# Altium schematic sheet mainSchematic.SchDoc
size 431 x 381 mm
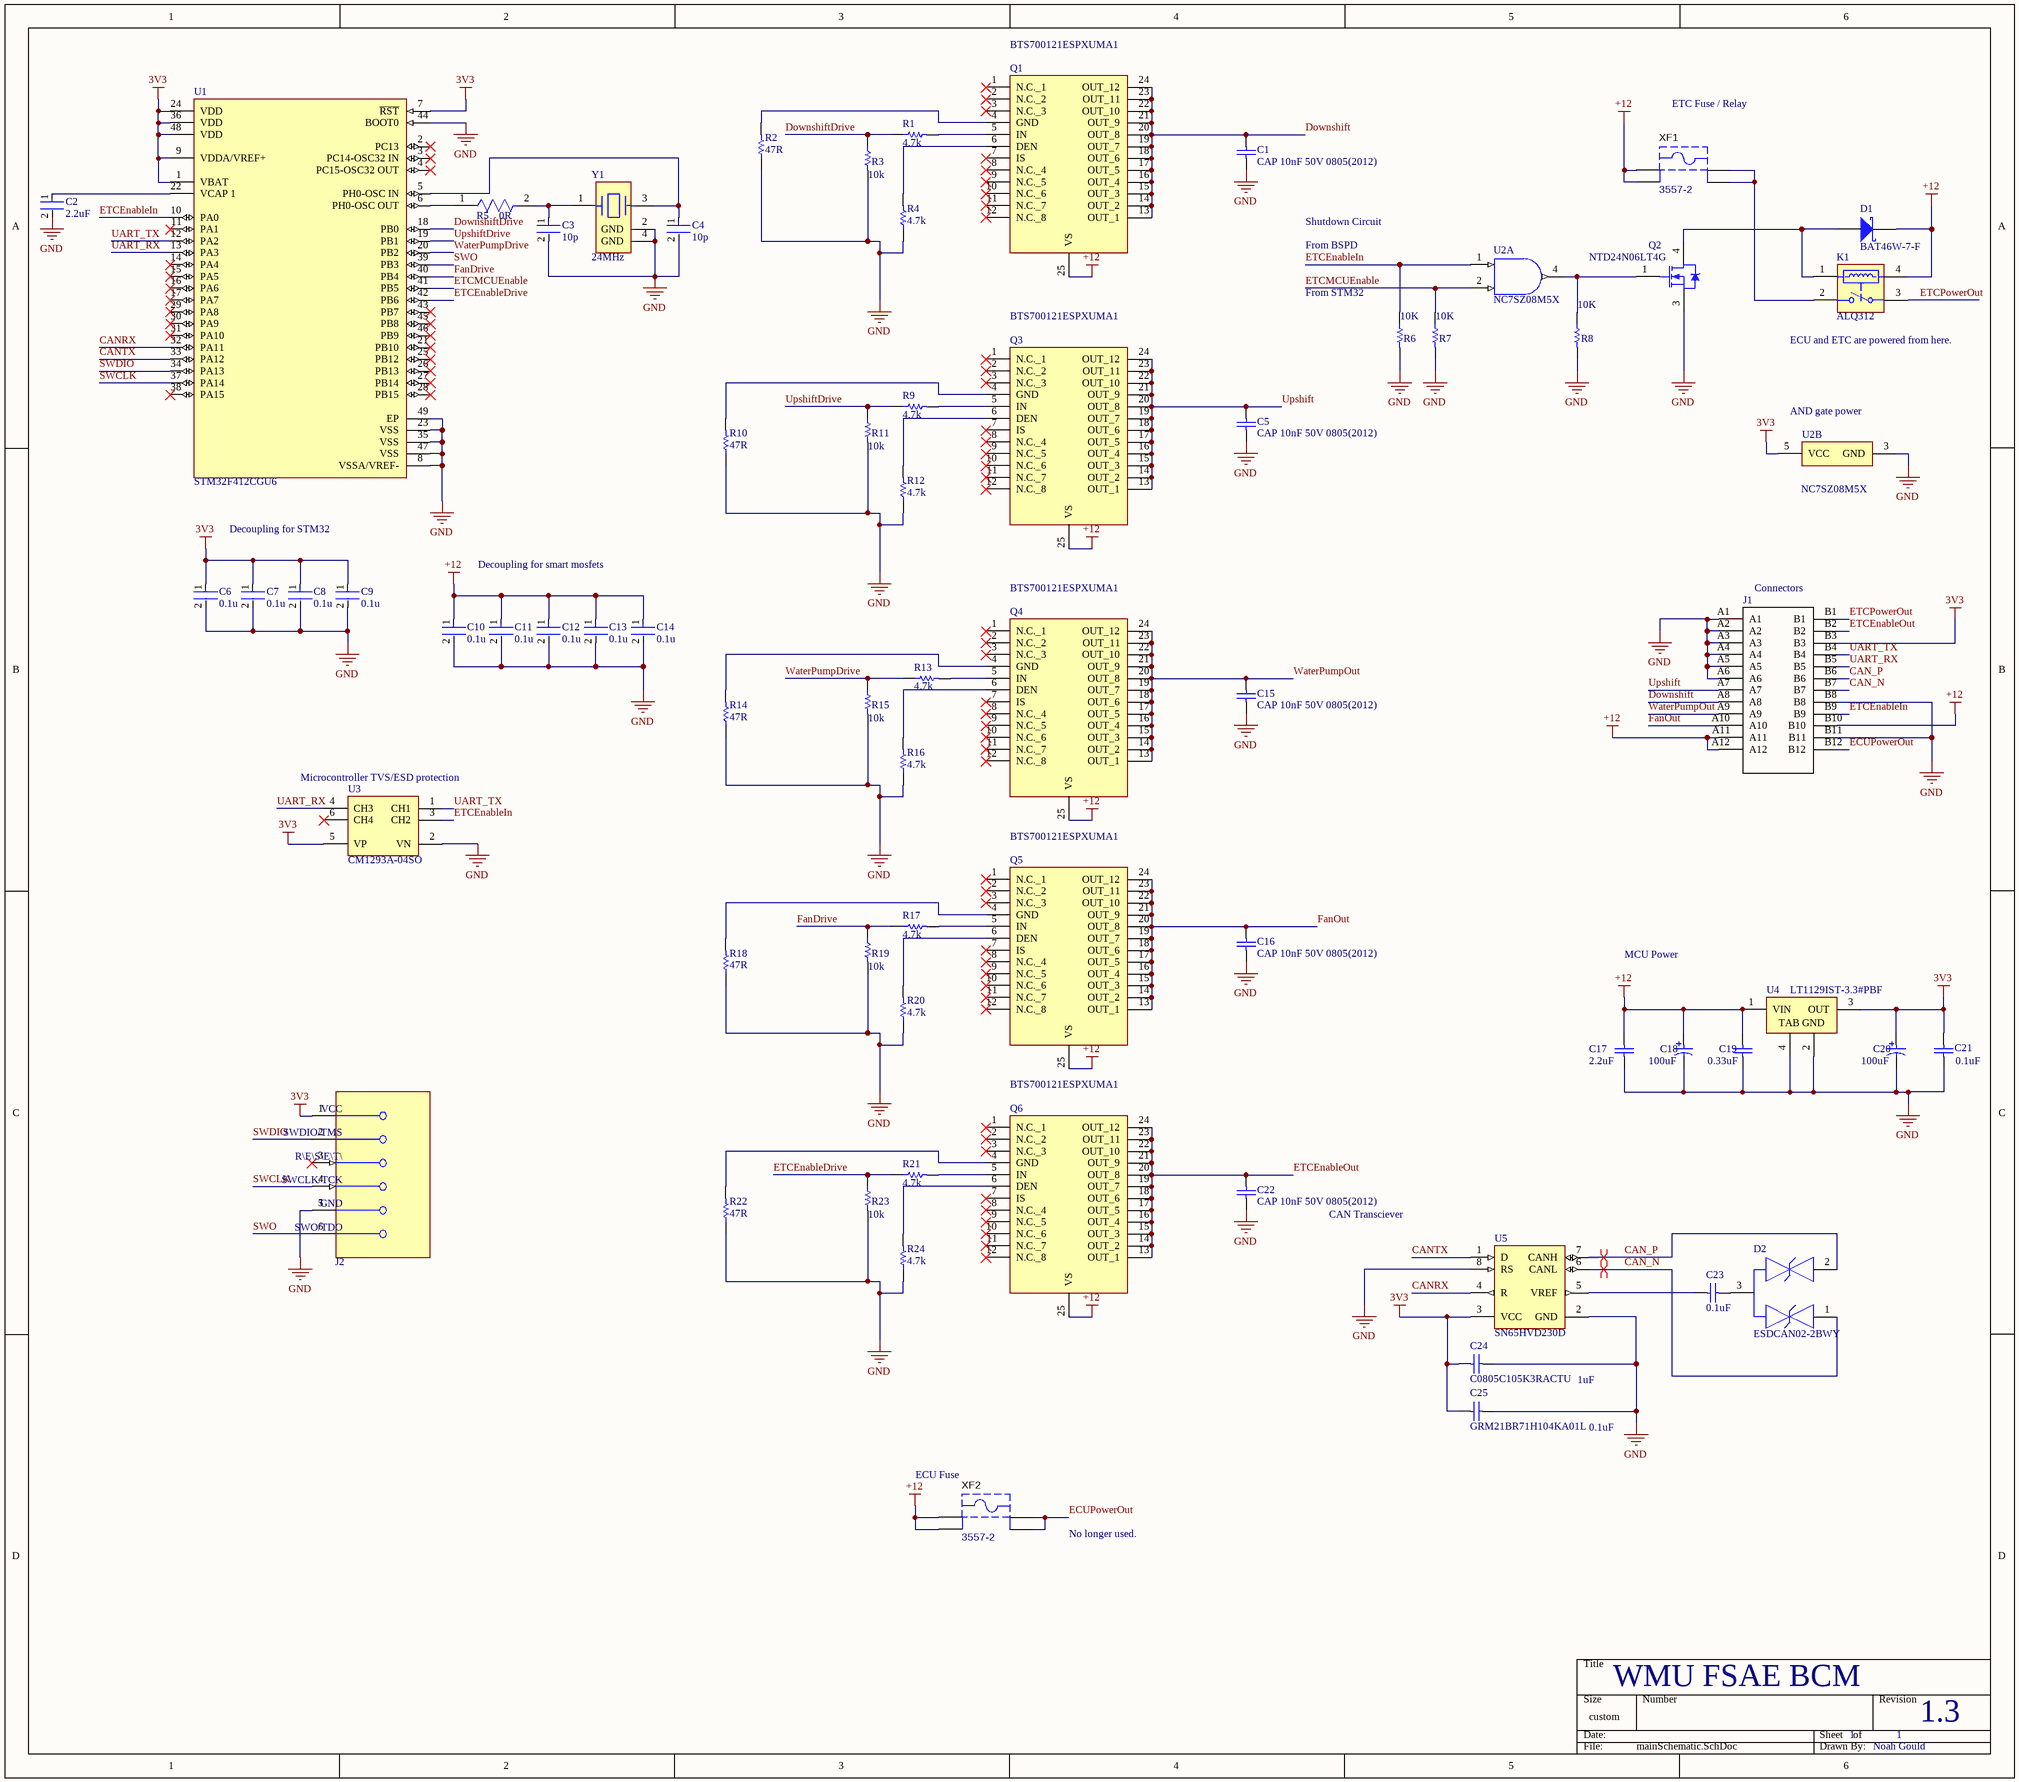
[diagram p0: mainSchematic.SchDoc]

## Parts
C1  CAP 10nF 50V 0805(2012)  [CAPC0805(2012)75_N]
C2  2.2uF  [FP-GRM188-0_1-e0_2_0_5-MFG]
C3  10p  [FP-0603-L_1_6_0_15-W_0_81-IPC_C]
C4  10p  [FP-0603-L_1_6_0_15-W_0_81-IPC_C]
C5  CAP 10nF 50V 0805(2012)  [CAPC0805(2012)75_N]
C6  0.1u  [FP-C0603C-CF-MFG]
C7  0.1u  [FP-C0603C-CF-MFG]
C8  0.1u  [FP-C0603C-CF-MFG]
C9  0.1u  [FP-C0603C-CF-MFG]
C10  0.1u  [FP-C0603C-CF-MFG]
C11  0.1u  [FP-C0603C-CF-MFG]
C12  0.1u  [FP-C0603C-CF-MFG]
C13  0.1u  [FP-C0603C-CF-MFG]
C14  0.1u  [FP-C0603C-CF-MFG]
C15  CAP 10nF 50V 0805(2012)  [CAPC0805(2012)75_N]
C16  CAP 10nF 50V 0805(2012)  [CAPC0805(2012)75_N]
C17  CAP 2.2uF 100V 1210(3225)  [CAPC1210(3225)280_N]  (value not drawn)
C18  EEEFK1H101P  [PNSC-FK-V-F_V]  (value not drawn)
C19  12065C334KAT2A  [CAPC3216X152X50LL20T25]  (value not drawn)
C20  EEEFK1H101P  [PNSC-FK-V-F_V]  (value not drawn)
C21  GRM21BR71H104KA01L  [CAPC2013X135X45ML10T25]  (value not drawn)
C22  CAP 10nF 50V 0805(2012)  [CAPC0805(2012)75_N]
C23  0.1uF  [CAPC2013X135X45ML10T25]
C24  C0805C105K3RACTU  [CAPC2013X140X50LL20T25]
C25  GRM21BR71H104KA01L  [CAPC2013X135X45ML10T25]
D1  BAT46W-7-F  [DIOD-SOD-123-2_V]
D2  ESDCAN02-2BWY  [FP-SOT323-3L-MFG]
J1  DTM1312PA12PBR008  [*TE_DTM1312PA12PBR008_DTM1312PA12PBR008(Primary)]  (value not drawn)
J2  TC2030-CTX-NL  [Tag_Connect_0_MFG]  (value not drawn)
K1  ALQ312  [PNSC-LQ-4-2000x1000x1600_V]
Q1  BTS700121ESPXUMA1  [SOP65P600X115-25N]
Q2  NTD24N06LT4G  [ONSC-DPAK-3-369C-01_V]
Q3  BTS700121ESPXUMA1  [SOP65P600X115-25N]
Q4  BTS700121ESPXUMA1  [SOP65P600X115-25N]
Q5  BTS700121ESPXUMA1  [SOP65P600X115-25N]
Q6  BTS700121ESPXUMA1  [SOP65P600X115-25N]
R1  4.7k  [RESC2013X70X40NL20T20]
R2  47R  [RESC2013X70X40NL20T20]
R3  10k  [RESC3216X70X50LL20T25]
R4  4.7k  [RESC2013X70X40NL20T20]
R5  0R  [FP-RC0603-MFG]
R6  ERA8AEB103V  [RESC3216X70X50LL20T25]  (value not drawn)
R7  ERA8AEB103V  [RESC3216X70X50LL20T25]  (value not drawn)
R8  ERA8AEB103V  [RESC3216X70X50LL20T25]  (value not drawn)
R9  4.7k  [RESC2013X70X40NL20T20]
R10  47R  [RESC2013X70X40NL20T20]
R11  10k  [RESC3216X70X50LL20T25]
R12  4.7k  [RESC2013X70X40NL20T20]
R13  4.7k  [RESC2013X70X40NL20T20]
R14  47R  [RESC2013X70X40NL20T20]
R15  10k  [RESC3216X70X50LL20T25]
R16  4.7k  [RESC2013X70X40NL20T20]
R17  4.7k  [RESC2013X70X40NL20T20]
R18  47R  [RESC2013X70X40NL20T20]
R19  10k  [RESC3216X70X50LL20T25]
R20  4.7k  [RESC2013X70X40NL20T20]
R21  4.7k  [RESC2013X70X40NL20T20]
R22  47R  [RESC2013X70X40NL20T20]
R23  10k  [RESC3216X70X50LL20T25]
R24  4.7k  [RESC2013X70X40NL20T20]
U1  STM32F412CGU6  [FP-UFQFPN48-A0B9-MFG]
U2  NC7SZ08M5X  [FAIR-SOT23-5_V]  (parts A,B of 2)
U3  CM1293A-04SO  [ONSC-SC-74-6-318F-05_V]
U4  LT1129IST-3.3#PBF  [LT-ST-3-SOT-223_L]
U5  SN65HVD230D  [D0008A_M]
XF1  3557-2  [KSTN-3557-2]
XF2  3557-2  [KSTN-3557-2]
Y1  24MHz  [FP-7M-MFG]

## Nets
3V3: C6.1 C7.1 C8.1 C9.1 C20.1 C21.1 C24.1 C25.1 J1.B3 J2.1(VCC) U1.1(VBAT) U1.7(~{RST}) U1.9(VDDA/VREF+) U1.24(VDD) U1.36(VDD) U1.48(VDD) U2.5(VCC) U3.5(VP) U4.3(OUT) U5.3(VCC)
+12: C10.1 C11.1 C12.1 C13.1 C14.1 C17.1 C18.1 C19.1 D1.2(K) J1.A11 J1.A12 J1.B10 K1.4 Q1.25(VS) Q3.25(VS) Q4.25(VS) Q5.25(VS) Q6.25(VS) U4.1(VIN) XF1.1 XF1.2 XF2.1 XF2.2
GND: C1.1 C2.2 C3.2 C4.2 C5.1 C6.2 C7.2 C8.2 C9.2 C10.2 C11.2 C12.2 C13.2 C14.2 C15.1 C16.1 C17.2 C18.2 C19.2 C20.2 C21.2 C22.1 C24.2 C25.2 J1.A1 J1.A2 J1.A3 J1.A4 J1.A5 J1.A6 J1.B8 J1.B11 J2.5(GND) Q2.3(S) R2.1 R3.2 R4.1 R6.2 R7.2 R8.2 R10.1 R11.2 R12.1 R14.1 R15.2 R16.1 R18.1 R19.2 R20.1 R22.1 R23.2 R24.1 U1.8(VSSA/VREF-) U1.23(VSS) U1.35(VSS) U1.44(BOOT0) U1.47(VSS) U1.49(EP) U2.3(GND) U3.2(VN) U4.2(GND) U4.4(TAB) U5.2(GND) U5.8(RS) Y1.2(GND) Y1.4(GND)
CAN_N: D2.1 J1.B7 U5.6(CANL)
CAN_P: D2.2 J1.B6 U5.7(CANH)
CANRX: U1.32(PA11) U5.4(R)
CANTX: U1.33(PA12) U5.1(D)
Downshift: C1.2 J1.A8 Q1.13(OUT_1) Q1.14(OUT_2) Q1.15(OUT_3) Q1.16(OUT_4) Q1.17(OUT_5) Q1.18(OUT_6) Q1.19(OUT_7) Q1.20(OUT_8) Q1.21(OUT_9) Q1.22(OUT_10) Q1.23(OUT_11) Q1.24(OUT_12)
DownshiftDrive: R1.1 R3.1 U1.18(PB0)
ECUPowerOut: J1.B12 XF2.3 XF2.4
ETCEnableDrive: R21.1 R23.1 U1.42(PB6)
ETCEnableIn: J1.B9 R6.1 U1.10(PA0) U2.1(A) U3.3(CH2)
ETCEnableOut: C22.2 J1.B2 Q6.13(OUT_1) Q6.14(OUT_2) Q6.15(OUT_3) Q6.16(OUT_4) Q6.17(OUT_5) Q6.18(OUT_6) Q6.19(OUT_7) Q6.20(OUT_8) Q6.21(OUT_9) Q6.22(OUT_10) Q6.23(OUT_11) Q6.24(OUT_12)
ETCMCUEnable: R7.1 U1.41(PB5) U2.2(B)
ETCPowerOut: J1.B1 K1.3(COM)
FanDrive: R17.1 R19.1 U1.40(PB4)
FanOut: C16.2 J1.A10 Q5.13(OUT_1) Q5.14(OUT_2) Q5.15(OUT_3) Q5.16(OUT_4) Q5.17(OUT_5) Q5.18(OUT_6) Q5.19(OUT_7) Q5.20(OUT_8) Q5.21(OUT_9) Q5.22(OUT_10) Q5.23(OUT_11) Q5.24(OUT_12)
SWCLK: J2.4(SWCLK/TCK) U1.37(PA14)
SWDIO: J2.2(SWDIO/TMS) U1.34(PA13)
SWO: J2.6(SWO/TDO) U1.39(PB3)
UART_RX: J1.B5 U1.13(PA3) U3.4(CH3)
UART_TX: J1.B4 U1.12(PA2) U3.1(CH1)
Upshift: C5.2 J1.A7 Q3.13(OUT_1) Q3.14(OUT_2) Q3.15(OUT_3) Q3.16(OUT_4) Q3.17(OUT_5) Q3.18(OUT_6) Q3.19(OUT_7) Q3.20(OUT_8) Q3.21(OUT_9) Q3.22(OUT_10) Q3.23(OUT_11) Q3.24(OUT_12)
UpshiftDrive: R9.1 R11.1 U1.19(PB1)
WaterPumpDrive: R13.1 R15.1 U1.20(PB2)
WaterPumpOut: C15.2 J1.A9 Q4.13(OUT_1) Q4.14(OUT_2) Q4.15(OUT_3) Q4.16(OUT_4) Q4.17(OUT_5) Q4.18(OUT_6) Q4.19(OUT_7) Q4.20(OUT_8) Q4.21(OUT_9) Q4.22(OUT_10) Q4.23(OUT_11) Q4.24(OUT_12)
NetC2_1: C2.1 U1.22(VCAP_1)
NetC3_1: C3.1 R5.2 Y1.1
NetC4_1: C4.1 U1.5(PH0-OSC_IN) Y1.3
NetC23_1: C23.1 U5.5(VREF)
NetC23_2: C23.2 D2.3
NetD1_1: D1.1(A) K1.1 Q2.4(D)
NetK1_2: K1.2(NO) XF1.3 XF1.4
NetQ1_4: Q1.4(GND) R2.2
NetQ1_5: Q1.5(IN) R1.2
NetQ1_6: Q1.6(DEN) R4.2
NetQ2_1: Q2.1(G) R8.1 U2.4(Y)
NetQ3_4: Q3.4(GND) R10.2
NetQ3_5: Q3.5(IN) R9.2
NetQ3_6: Q3.6(DEN) R12.2
NetQ4_4: Q4.4(GND) R14.2
NetQ4_5: Q4.5(IN) R13.2
NetQ4_6: Q4.6(DEN) R16.2
NetQ5_4: Q5.4(GND) R18.2
NetQ5_5: Q5.5(IN) R17.2
NetQ5_6: Q5.6(DEN) R20.2
NetQ6_4: Q6.4(GND) R22.2
NetQ6_5: Q6.5(IN) R21.2
NetQ6_6: Q6.6(DEN) R24.2
NetR5_1: R5.1 U1.6(PH0-OSC_OUT)

Not connected (* = marked no-connect by the designer): J2 3(~{RESET})*; Q1 1(N.C._1)* 2(N.C._2)* 3(N.C._3)* 7(IS)* 8(N.C._4)* 9(N.C._5)* 10(N.C._6)* 11(N.C._7)* 12(N.C._8)*; Q3 1(N.C._1)* 2(N.C._2)* 3(N.C._3)* 7(IS)* 8(N.C._4)* 9(N.C._5)* 10(N.C._6)* 11(N.C._7)* 12(N.C._8)*; Q4 1(N.C._1)* 2(N.C._2)* 3(N.C._3)* 7(IS)* 8(N.C._4)* 9(N.C._5)* 10(N.C._6)* 11(N.C._7)* 12(N.C._8)*; Q5 1(N.C._1)* 2(N.C._2)* 3(N.C._3)* 7(IS)* 8(N.C._4)* 9(N.C._5)* 10(N.C._6)* 11(N.C._7)* 12(N.C._8)*; Q6 1(N.C._1)* 2(N.C._2)* 3(N.C._3)* 7(IS)* 8(N.C._4)* 9(N.C._5)* 10(N.C._6)* 11(N.C._7)* 12(N.C._8)*; U1 2(PC13)* 3(PC14-OSC32_IN)* 4(PC15-OSC32_OUT)* 11(PA1)* 14(PA4)* 15(PA5)* 16(PA6)* 17(PA7)* 21(PB10)* 25(PB12)* 26(PB13)* 27(PB14)* 28(PB15)* 29(PA8)* 30(PA9)* 31(PA10)* 38(PA15)* 43(PB7)* 45(PB8)* 46(PB9)*; U3 6(CH4)*

## Layout directives
differential pair: CAN_N, CAN_P

## Notes on the sheet
- ETC Fuse / Relay
- Shutdown Circuit
- From BSPD
- From STM32
- (near R6) 10K
- (near R7) 10K
- (near R8) 10K
- (near K1) ECU and ETC are powered from here.
- (near U2) AND gate power
- Decoupling for STM32
- Decoupling for smart mosfets
- (near J1) Connectors
- (near U3) Microcontroller TVS/ESD protection
- MCU Power
- (near C17) 2.2uF
- (near C18) 100uF
- (near C19) 0.33uF
- (near C20) 100uF
- (near C21) 0.1uF
- CAN Transciever
- 1uF
- 0.1uF
- (near XF2) ECU Fuse
- No longer used.
- WMU FSAE BCM
- 1
- 1.3
- Noah Gould

## Library data of the parts
C1 C5 C15 C16 C22 = CMP-1036-03839-1: CAP 10nF 50V ±5% 0805 (2012 Metric) Thickness 0.75mm SMD; Case-Metric: 2012; Case-EIA: 0805; Tolerance: Â±5%; Technology: SMT; Max Thickness: 0.75 mm; Rated Voltage: 50 V; Value: 10nF
C2 = CMP-2006-02836-2: Chip Multilayer Ceramic Capacitors for General Purpose, 0603, 2.2uF, X7R, 15%, 10%, 10V; Case Code (Metric): 1608; Height: 0.8mm; Packaging: Cut Tape; Voltage: 10V; Lead Free: Lead Free; Min Operating Temperature: -55°C; Voltage Rating (DC): 10V; Max Operating Temperature: 125°C; Voltage Rating: 10V; Dielectric: X7R; Depth: 0.8mm; Case Code (Imperial): 0603; Termination: SMD/SMT; Case/Package: 0603; Number of Pins: 2; REACH SVHC: No SVHC; Mount: Surface Mount; Width: 0.031inch; Material: Ceramic; Capacitance: 2.2uF; Package Quantity: 1; Weight: 7.1E-05oz; Length: 1.6mm; Thickness: 0.035inch; Tolerance: 10%
C3 C4 = CMP-2006-04216-2: General Purpose Ceramic Capacitor, 0603, 10pF, 10%, NP0, 30ppm/°C, 50V; Dielectric: C0G; Case Code (Imperial): 0603; Tolerance: 10%; Thickness: 0.035inch; Contact Plating: Tin; Termination: SMD/SMT; Case/Package: 0603; Max Operating Temperature: 125°C; Packaging: Tape and Reel; REACH SVHC: No SVHC; Case Code (Metric): 1608; Lead Free: Lead Free; Radiation Hardening: No; Mount: Surface Mount; RoHS Compliant: Yes; Voltage Rating: 50V; Voltage Rating (DC): 50V; Series: -; Construction: Flat; Min Operating Temperature: -55°C; Width: 0.032inch; Voltage: 50V; Number of Pins: 2; Package Quantity: 1; Depth: 0.81mm; Capacitance: 10pF; Length: 1.6mm
C6-C14 = CMP-2006-03061-2: CAP CER 0.1UF 50V X7R 0603; Manufacturer: KEMET; Manufacturer Part Number: C0603C104K5RACTU; Tolerance: 0.1; Temperature Coefficient: 30ppm/°C; Material: Ceramic; Automotive Grade: Grade 1; Value: 0.10 μF; Temperature: -55°C to +125°C; RoHS: TRUE; Temperature Range High: +125°C; Lead Free: Yes; Octopart: https://octopart.com/c0603c104k5ractu-kemet-139244; Digikey Description: CAP CER 0.1UF 50V X7R 0603; Category: Cap; Package: C0603C-CF; ComponentLink2Description: Datasheet; Temperature Range Low: -55°C; Device Class L1: Passive Components; Voltage Rating: 50 V; Automotive: Yes; Device Class L3: Ceramic Capacitors; ComponentLink2URL: https://api.kemet.com/component-edge/download/datasheet/C0603C100J5GACAUTO.pdf; Capacitance: 0.10 μF; Device Class L2: Capacitors; Temperature Characteristic: X7R; Height: 0.87mm
C17 = CMP-1038-02104-1: CAP 2.2uF 100V ±10% 1210 (3225 Metric) Thickness 2.8mm SMD; Case-Metric: 3225; Tolerance: Â±10%; Case-EIA: 1210; Rated Voltage: 100 V; Value: 2.2uF; Technology: SMT; Max Thickness: 2.8 mm
C18 C20 = CMP-2000-06208-1: Aluminum Electrolytic Capacitor, 100 uF, +/- 20%, 50 V, 2-Pin SMD (Size Code F), -55 to 105 degC, RoHS, Tape and Reel; Manufacturer: Panasonic; Impedance: 0.34O; Lifetime@Temperature: 2000Hrs@105°C; Ripple Current: 350mA; Type: Can; Rated Voltage: 50V; Capacitance: 100µF; Mounting Technology: SurfaceMount; Series: FK; Package URL: http://industrial.panasonic.com/cdbs/www-data/pdf/RDE0000/DME0000COL48.pdf; Datasheet URL: http://industrial.panasonic.com/cdbs/www-data/pdf/RDE0000/ABA0000C1181.pdf; Package Reference: FK-V-F; Operating Temp-Max: 105°C; Manufacturer URL: http://www.panasonic.com/; Operating Temp Range: -55to+105°C; Package Description: 2-Pin Electrolytic Aluminum Capacitor, Body 8.3 x 8.3 mm; Datasheet Version: 03/2016; Case Size/Dimension: Ø8x10.2mm
C19 = CMP-2000-05868-1: Chip Capacitor, 330 nF, +/- 10%, 50 V, -55 to 125 degC, 1206 (3216 Metric), RoHS, Tape and Reel; Manufacturer: AVX; Dielectric: X7R; Capacitance: 330nF; Rated Voltage: 50V; Package Reference: 1206; Tolerance (%): ±10%; Datasheet Version: 07/2016; Manufacturer URL: http://www.avx.com/; Case Size/Dimension: 1206; Datasheet URL: http://datasheets.avx.com/X7RDielectric.pdf; Package Description: 2-Pin Surface Mount Device, Body 3.2 x 1.6 mm; Mounting Technology: SurfaceMount
C21 C23 C25 = CMP-2100-03644-1: Chip Capacitor, 0.1 uF, +/- 10%, 50 V, -55 to 125 degC, 0805 (2012 Metric), RoHS, Tape and Reel; Manufacturer: Murata; Voltage: 50V; Capacitance: 100nF; Insulation Resistance: 10GR; Dielectric Material: Ceramic; Dielectric: X7R; Package Description: 2-Pin Surface Mount Device, Body 2 x 1.25 mm; Manufacturer URL: http://www.murata.com/; Case Code (Imperial): 0805; Datasheet URL: http://psearch.en.murata.com/capacitor/product/GRM21BR71H104KA01%23.pdf; Termination: SMD/SMT; Lead Free: LeadFree; Package Quantity: 1; Mount: SurfaceMount; REACH SVHC: Unknown; Thickness: 0.053inch; Height: 1.25mm; Case/Package: 0805; Voltage Rating: 50V; Width: 0.049inch; Case Code (Metric): 2012; Material: Ceramic; Min Operating Temperature: -55degC; RoHSCompliant: true; Datasheet Version: 42675.0; Voltage Rating (DC): 50V; Tolerance: 10%; Package Reference: 0805; Depth: 1.25mm; Length: 2mm; Max Operating Temperature: 125degC; Packaging: TapeandReel; Number of Pins: 2; Radiation Hardening: No
C24 = CMP-2007-03234-1: Manufacturer: Kemet; Part Number: C0805C105K3RACTU
D1 = CMP-0303-00004-1: Surface Mount Schottky Barrier Diode, 100 V, -55 to 125 degC, 2-Pin SOD123, RoHS, Tape and Reel; Manufacturer: Diodes Inc; IR@1.5 V: 0.3 uA Max.; V(BR)R: 100 V Min.; VF@10 mA: 0.45 V Max.; CT@1 V: 12 pF Typ.; PartNumber: BAT46W-7-F; ComponentLink1URL: http://www.diodes.com/; ComponentLink3URL: http://diodes.com/datasheets/ds30044.pdf; PackageDescription: 2-Pin SMD, Body 2.7 x 1.55 mm, Height 1.45 mm; ComponentLink2Description: Datasheet; ComponentLink3Description: Package Specification; Mounting Technology: Surface Mount; ComponentLink1Description: Manufacturer URL; RoHS: TRUE; Operating Temperature: -55 to 125 degC; Packing: Tape and Reel; ComponentLink2URL: http://diodes.com/datasheets/ds30044.pdf; DatasheetVersion: Rev. 16-2
D2 = CMP-12225-000055-1: TVS DIODE 26.5V 44V SOT323-3; Manufacturer: STMicroelectronics; Value: 3pF; Direction: Bidirectional; Breakdown Voltage: 28.5V; Automotive Grade: Grade 0; Standoff Height: 0mm; Peak Pulse Power: 170W; Peak Pulse Current: 3A; Number Of Channels: 2; Max Junction Temp: +175°C; Mouser Description: TVS Diodes / ESD Suppressors Automotive dual-line Transil, Transient voltage suppressor (TVS) for CAN bus; Height: 1.1mm; Category: Diode; Reverse Standoff Voltage: 26.5V; Device Class L1: Circuit Protection; Temperature: -55°C to +175°C; RoHS: TRUE; ComponentLink2URL: https://www.st.com/resource/en/datasheet/esdcan02-2bwy.pdf; Device Class L3: unset; Device Class L2: TVS Diodes; Temperature Range High: +175°C; Octopart: https://octopart.com/esdcan02-2bwy-stmicroelectronics-58631133; Ipc Land Pattern Name: SOT65P210X95-3; Temperature Range Low: -55°C; Capacitance: 3pF; Digikey Description: TVS DIODE 26.5V 44V SOT323-3; Automotive: Yes; ComponentLink2Description: Datasheet; Clamping Voltage: 44V; Manufacturer Part Number: ESDCAN02-2BWY; Lead Free: Yes; Package: SOT323-3L
J1 = DTM1312PA12PBR008: Double Header 24 pin receptacle; MP: DTM13-12PA-12PB-R008; MF: TE Connectivity; Price: None; Package: None; Availability: Unavailable; TE_purchase_URL: https://www.te.com/usa-en/product-DTM1312PA12PBR008.html?te_bu=Cor&te_type=disp&te_campaign=seda_glo_cor-seda-global-disp-prtnr-fy19-seda-model-bom-cta_sma-317_1&elqCampaignId=32493; SnapEDA_Link: https://www.snapeda.com/parts/DTM13-12PA-12PB-R008/TE%20Connectivity%20Deutsch%20Connectors/view-part/?ref=snap; Value: *
K1 = CMP-1503-00190-1: LQ Relays, 12 V Coil Voltage, 200 mW Nominal Operating Power, -40 to 85 degC, 4-Pin LQ, Carton, Case, RoHS; Manufacturer: Panasonic; Pb-Free: True; Nominal Operating Power: 200 mW; Max Switching Current: 10 A (N.O.), 3 A (N.C.); Electrical Life: 5x10^4; Coil Voltage: 12 V; Mechanical Life(Min.operation): 1x10^7; Max Switching Voltage: 250 V AC; Mounting Technology: Through Hole; ComponentLink3URL: http://www3.panasonic.biz/ac/e_download/control/relay/power/catalog/mech_eng_lq.pdf?f_cd=401220; Series: LQ Relays; Packing: Carton, Case; RoHS: True; PackageVersion: ASCTB92E, 10/2014; ComponentLink1URL: http://www3.panasonic.biz/ac/ae/index.jsp; PartNumber: ALQ312; PackageReference: LQ-4-2000x1000x1600; PackageDescription: 4-Pin Through Hole Terminal Package, Body 20 x 10 mm; ComponentLink2URL: http://www3.panasonic.biz/ac/e_download/control/relay/power/catalog/mech_eng_lq.pdf?f_cd=401220; ComponentLink3Description: Package Specification; ComponentLink2Description: Datasheet; ComponentLink1Description: Manufacturer URL; DatasheetVersion: 201410-T
Q1 Q3-Q6 = BTS700121ESPXUMA1: Integrated Circuit; Manufacturer_Name: Infineon; Datasheet Link: https://www.infineon.com/dgdl/Infineon-BTS70012-1ESP-DataSheet-v01_10-EN.pdf?fileId=5546d462758f5bd1017598473e2a39a7; Height: 1.15mm; Manufacturer_Part_Number: BTS700121ESPXUMA1; Mouser Part Number: 726-BTS700121ESPXUMA; Mouser Price/Stock: https://www.mouser.co.uk/ProductDetail/Infineon-Technologies/BTS700121ESPXUMA1?qs=81r%252BiQLm7BTuVhpblMU93g%3D%3D
Q2 = CMP-1058-00417-1: Power MOSFET, 24 A, 60 V, Logic Level, N-Channel, 3-Pin DPAK, Pb-Free, Tape and Reel; Manufacturer: On Semiconductor; Ciss Typ (pF): 814; VGS(th) Max (V): 2; Crss Typ (pF): 80; Channel Polarity: N Channel; Qrr Typ (nC): 84; Configuration: Single; Coss Typ (pF): 258; V(BR)DSS Min (V): 60; ComponentLink3URL: http://www.onsemi.cn/pub_link/Collateral/369C.PDF; PackageDescription: 3-Pin Flange Mount, Body 6.54 x 6.095 mm, Pitch 2.29 mm; ComponentLink1Description: Manufacturer URL; Mounting Technology: Surface Mount; ComponentLink1URL: http://www.onsemi.com/; ComponentLink2Description: Datasheet; RoHS: Pb-Free; Packing: Tape and Reel; DatasheetVersion: Rev. 3; ComponentLink2URL: http://www.onsemi.cn/pub_link/Collateral/NTD24N06L-D.PDF; Package Type: DPAK-3; ComponentLink3Description: Package Specification; PartNumber: NTD24N06LT4G; PackageReference: DPAK-3-369C-01; PackageVersion: Rev. E, 02/2014
R1 R4 R9 R12 R13 R16 R17 R20 R21 R24 = CMP-2001-00550-5: Chip Resistor, 4.7 KOhm, +/- 1%, 0.125 W, -55 to 155 degC, 0805 (2012 Metric), RoHS, Tape and Reel; Manufacturer: Panasonic; Voltage Rating: 150 V; Min Operating Temperature: -55 degC; PackageReference: 0805; Mounting Technology: Surface Mount; Height: 0.6 mm; PackageDescription: 2-Pin Surface Mount Device, Body 2 x 1.25 mm; RoHSCompliant: true; Length: 2 mm; REACH SVHC: Yes; Packaging: Tape and Reel; Pins: 2; Mount: Surface Mount; ComponentLink2Description: Datasheet; ComponentLink1URL: http://www.panasonic.com/; ComponentLink1Description: Manufacturer URL; DatasheetVersion: 04/2015; Package Quantity: 5000; ComponentLink2URL: http://industrial.panasonic.com/cdbs/www-data/pdf/RDA0000/AOA0000C86.pdf; Max Operating Temperature: 155 degC
R2 R10 R14 R18 R22 = CMP-2001-00205-1: Part Number: ERJ6ENF47R0V; Manufacturer: Panasonic
R3 R11 R15 R19 R23 = CMP-2003-04407-1: Manufacturer: Panasonic; Part Number: ERA8AEB103V
R5 = CMP-2000-06925-2: RES SMD 0 OHM JUMPER 1/10W 0603; Manufacturer: Yageo; Manufacturer Part Number: RC0603FR-070RL; Tolerance: 1%; Value: 0Ω; Power Rating: 0.1W; Voltage Rating: 75V; Composition: Thick Film; Temperature Range Low: -55°C; Ipc Land Pattern Name: RESC16080X45; Lead Free: Yes; Digikey Description: RES SMD 0 OHM JUMPER 1/10W 0603; Height: 0.55mm; Automotive: No; Device Class L3: Chip SMD Resistors; Device Class L1: Passive Components; Device Class L2: Resistors; Footprint Url: http://www.yageo.com/exep/pages/download/literatures/PYu-R_Mount_10.pdf; Category: Res; Mouser Description: RC Series 0603 0.1 W 0 O Jumper Surface Mount Thick Film Chip Resistor; Resistance: 0Ω; ComponentLink2URL: http://www.yageo.com/documents/recent/PYu-RC_Group_51_RoHS_L_10.pdf; Series: RC_L; ComponentLink2Description: Datasheet; RoHS: TRUE; Temperature: -55°C to +155°C; Temperature Range High: +155°C; Package: RC0603; Octopart: https://octopart.com/rc0603fr-070rl-yageo-1180803
R6-R8 = CMP-2003-04407-1: Manufacturer: Panasonic; Part Number: ERA8AEB103V
U1 = CMP-12105-000086-1: IC MCU 32BIT 1MB FLASH 48UFQFPN; Frequency: 100MHz; Peripherals: Brown-out Detect/Reset; Number of I/Os: 36; Interface: I2C; Core Architecture: ARM; Oscillator Type: Internal; Memory Type: FLASH; Memory Size: 1MB; Min Operating Temperature: -40°C; Max Operating Temperature: 85°C
U2 = CMP-2000-06815-1: TinyLogic(R) UHS 2-Input AND Gate, 1.65 to 5.5 V, -40 to 85 degC, 5-Pin SOT23, RoHS, Tape and Reel; Manufacturer: FairchildSemiconductor; Logic Family: NC7SV; Package Version: 08/2015; Low Level Output Current: 32mA; Number of Gates: 1Gate; Number of Input Lines: 2Input; Propagation Delay Time: 5.2ns; Unit Weight: 0.001058oz; High Level Output Current: -32mA; Supply Voltage - Min: 1.65V; Supply Voltage - Max: 5.5V; Number of Output Lines: 1Output; Maximum Operating Temperature: +85C; Package Reference: SOT23-5; Package URL: https://www.fairchildsemi.com/package-drawings/MA/MA05B.pdf; Package Description: 5-Pin Small Outline Transistor, Body 2.9 x 1.6 mm, Pitch 0.95 mm; Datasheet URL: https://www.fairchildsemi.com/datasheets/NC/NC7SZ08.pdf; Manufacturer URL: https://www.fairchildsemi.com/; Product Category: LogicGates; Series: TinyLogic; Mounting Technology: SurfaceMount; RoHS: True; Packaging: Reel; Mounting Style: SMD/SMT; Logic Type: 2-InputAND; Minimum Operating Temperature: -40C; <PCN>: http://www.mouser.com/PCN/3.26.10LTBDFairchild.pdf; Brand: FairchildSemiconductor; Product: Single-FunctionGate; Package / Case: SOT-23; Datasheet Version: Rev. 1.0.3, 09/2009; Logic Function: AND
U3 = CMP-1063-00076-1: 4-Channel Low Capacitance ESD Protection Array, 6-Pin SC-74, Pb-Free, Tape and Reel; Manufacturer: On Semiconductor; Number of Lines: 4; IR Max (uA): 1; C Max (pF): 2; Direction: Unidirectional; PPK Max (W): 0.225; ComponentLink3URL: http://www.onsemi.com/pub_link/Collateral/318F-05.PDF; RoHS: Pb-Free; PackageVersion: Rev. N, 06/2012; ComponentLink1Description: Manufacturer URL; Mounting Technology: Surface Mount; PackageReference: SC-74-6-318F-05; PackageDescription: 6-Pin Small Outline Transistor, Body 3 x 1.5 mm, Pitch 0.95 mm; ComponentLink2Description: Datasheet; ComponentLink3Description: Package Specification; PartNumber: CM1293A-04SO; Packing: Tape and Reel; ComponentLink1URL: http://www.onsemi.com/; DatasheetVersion: Rev. 0; ComponentLink2URL: http://www.onsemi.com/pub_link/Collateral/CM1293A-04SO-D.PDF
U4 = CMP-0476-01834-1: Micropower Low Dropout Regulator with Shutdown, 4.15 to 30 V Vin, 3.3 V Vout, 3-pin SOT223 (ST-3), -40 to 125 degC, Pb-Free; Manufacturer: Linear Technology; Vin Min(V): 4.15; Iout(mA): 700; Number of Outputs: 1; Vin Max(V): 30; Dropout Voltage(V): 0.45; PSRR(dB): 64; Discrete Pass Element: no; Shutdown Current(uA): 16; Output Voltage: 3.3 V; Isupply(mA): 0.05; RoHS: TRUE; PartNumber: LT1129IST-3.3#PBF; ComponentLink3URL: http://cds.linear.com/docs/en/packaging/SOT_3_05-08-1630.pdf; PackageReference: ST-3; ComponentLink3Description: Package Specification; PackageDescription: 3-Pin Plastic SOT-223, 3.505 x 6.505 mm Body, Pitch 2.3 mm; Mounting Technology: Surface Mount; DatasheetVersion: Rev. F; ComponentLink2URL: http://cds.linear.com/docs/en/datasheet/112935ff.pdf; ComponentLink1URL: http://www.linear.com/; PackageVersion: Jun-10; ComponentLink2Description: Datasheet; ComponentLink1Description: Manufacturer URL
U5 = CMP-0315-00046-3: CAN Bus Transceiver, 3.3 V, -40 to 85 degC, 8-Pin SOIC (D), Green (RoHS & no Sb/Br), Tube; Supply Voltage Min: 3 V; Supply Voltage Max: 3.6 V; PartNumber: SN65HVD230D; ComponentLink2URL: http://www.ti.com/general/docs/lit/getliterature.tsp?genericGeneric Part Number=SN65HVD230&fileType=pdf; DatasheetVersion: SLOS346N; Generic Part Number: SN65HVD230; Packing: Tube; Temperature Min: -40 degC; Temperature Max: 85 degC; ComponentLink1Description: Manufacturer URL; Mounting Technology: Surface Mount; RoHS: TRUE; ComponentLink1URL: http://www.ti.com/; ComponentLink2Description: Datasheet; PackageDescription: 8-Pin Plastic Small Outline, Body 4.9 x 3.9 mm, Pitch 1.27 mm
XF1 XF2 = CMP-2000-05461-1: FUSE HOLDER, PCB MOUNT, 500VAC, 20A, ROHS; Manufacturer: Keystone-Electronics; Number of Circuits: 1; Voltage: 500V; Fuseholder Type: Block; Fuse Type: Blade; Fuse Size: 0.43"Lx0.15"Wx0.64"H(10.92mmx3.81mmx16.25mm); For Use With/Related Products: ATC,ATO257,MINI897; Current Rating: 30A; Datasheet URL: http://datasheet.octopart.com/3557-2-Keystone-datasheet-15715937.pdf; Orientation: Vertical; Family: Fuseholders; Datasheet Version: Apr-13; Contact Finish: TinNickel; Mounting Type: PCB; Series: -; Category: CircuitProtection; Termination Style: PCPin; Contact Material: Brass; Manufacturer URL: http://www.keyelco.com/
Y1 = CMP-18717-000318-1: Crystal 24MHz, 10ppm, 10pF, 50Ω; ESR (Equivalent Series Resistance): 60R; Lead Free: Lead Free; Packaging: Tape and Reel; Length: 3.2mm; Frequency: 24MHz; Load Capacitance: 10pF; REACH SVHC: No SVHC; Width: 0.098inch; Height: 0.031inch; Tolerance: 10ppm; Frequency Stability: 10ppm; Min Operating Temperature: -20°C; Max Operating Temperature: 70°C; Frequency Tolerance: 10ppm; Number of Pins: 4; Mount: Surface Mount; Termination: SMD/SMT; Case/Package: SMD/SMT; Package Quantity: 3000; Depth: 2.5mm; Series: 7M